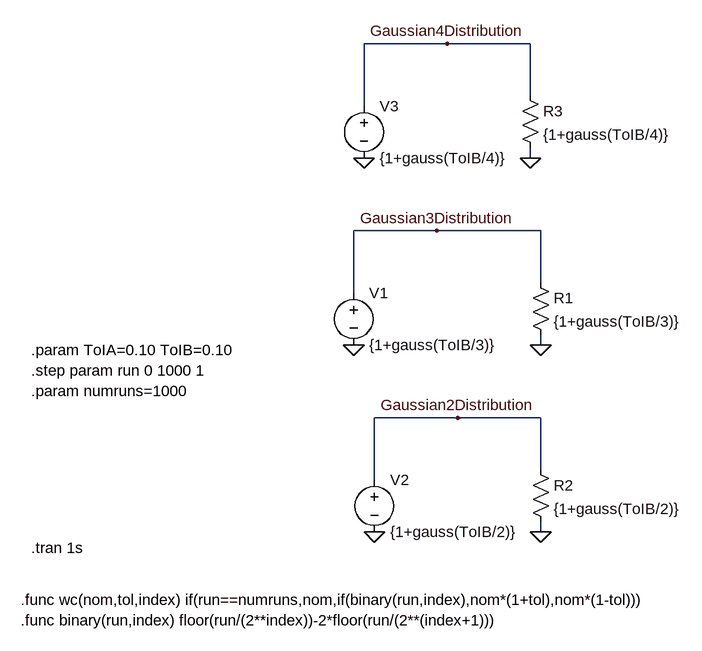
[diagram p0: schematic ShowDistributionGaussian.asc]
ShowDistributionGaussian.asc, the LTspice schematic file:
Version 4
SHEET 1 1816 680
WIRE 544 -416 416 -416
WIRE 672 -416 544 -416
WIRE 672 -336 672 -416
WIRE 416 -320 416 -416
WIRE 672 -240 672 -256
WIRE 528 -128 400 -128
WIRE 688 -128 528 -128
WIRE 688 -48 688 -128
WIRE 400 -32 400 -128
WIRE 688 48 688 32
WIRE 560 160 432 160
WIRE 688 160 560 160
WIRE 688 240 688 160
WIRE 432 256 432 160
WIRE 688 336 688 320
FLAG 400 48 0
FLAG 528 -128 Gaussian3Distribution
FLAG 432 336 0
FLAG 560 160 Gaussian2Distribution
FLAG 688 48 0
FLAG 688 336 0
FLAG 416 -240 0
FLAG 544 -416 Gaussian4Distribution
FLAG 672 -240 0
SYMBOL voltage 400 -48 R0
WINDOW 123 0 0 Left 0
WINDOW 39 0 0 Left 0
SYMATTR InstName V1
SYMATTR Value {1+gauss(ToIB/3)}
SYMBOL voltage 432 240 R0
WINDOW 123 0 0 Left 0
WINDOW 39 0 0 Left 0
SYMATTR InstName V2
SYMATTR Value {1+gauss(ToIB/2)}
SYMBOL res 672 -64 R0
SYMATTR InstName R1
SYMATTR Value {1+gauss(ToIB/3)}
SYMBOL res 672 224 R0
SYMATTR InstName R2
SYMATTR Value {1+gauss(ToIB/2)}
SYMBOL voltage 416 -336 R0
WINDOW 123 0 0 Left 0
WINDOW 39 0 0 Left 0
SYMATTR InstName V3
SYMATTR Value {1+gauss(ToIB/4)}
SYMBOL res 656 -352 R0
SYMATTR InstName R3
SYMATTR Value {1+gauss(ToIB/4)}
TEXT -96 56 Left 2 !.param ToIA=0.10 ToIB=0.10\n.step param run 0 1000 1\n.param numruns=1000
TEXT -96 360 Left 2 !.tran 1s
TEXT -112 440 Left 2 !.func wc(nom,tol,index) if(run==numruns,nom,if(binary(run,index),nom*(1+tol),nom*(1-tol)))
TEXT -112 472 Left 2 !.func binary(run,index) floor(run/(2**index))-2*floor(run/(2**(index+1)))

The netlist it stands for:
* ShowDistributionGaussian.asc
V1 Gaussian3Distribution 0 {1+gauss(ToIB/3)}
V2 Gaussian2Distribution 0 {1+gauss(ToIB/2)}
R1 Gaussian3Distribution 0 {1+gauss(ToIB/3)}
R2 Gaussian2Distribution 0 {1+gauss(ToIB/2)}
V3 Gaussian4Distribution 0 {1+gauss(ToIB/4)}
R3 Gaussian4Distribution 0 {1+gauss(ToIB/4)}
.param ToIA=0.10 ToIB=0.10
.step param run 0 1000 1
.param numruns=1000
.tran 1s
.func wc(nom,tol,index) if(run==numruns,nom,if(binary(run,index),nom*(1+tol),nom*(1-tol)))
.func binary(run,index) floor(run/(2**index))-2*floor(run/(2**(index+1)))
.backanno
.end